# EAGLE schematic logger (EAGLE 6.4)
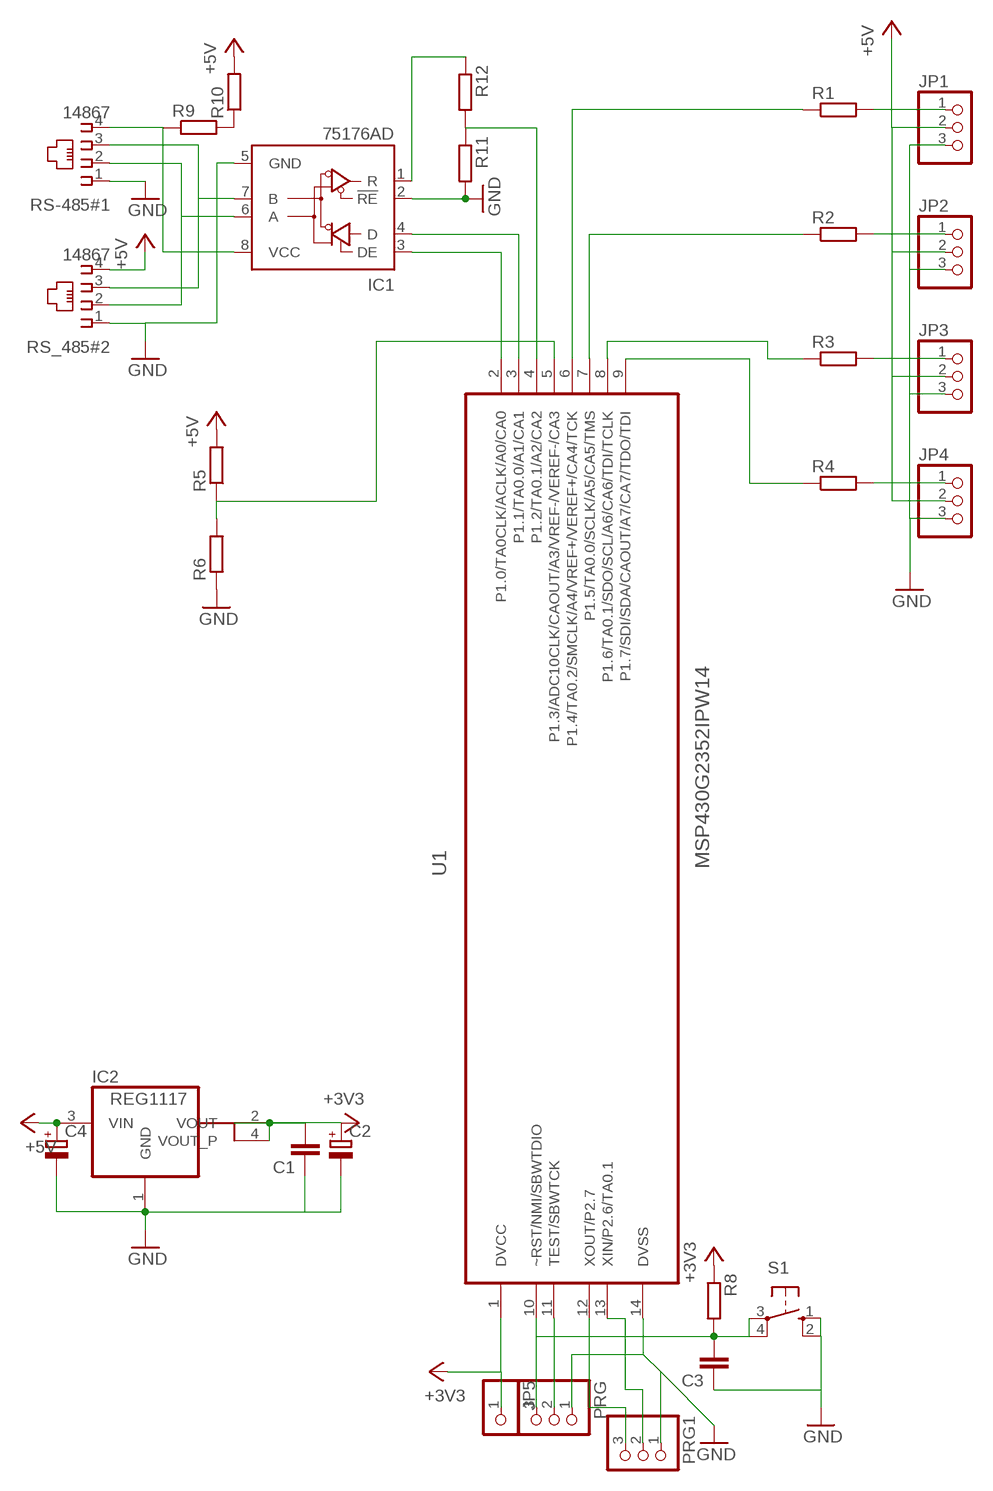
[diagram p0: schematic, sheet 1]

## Parts
C1  C-EUC0805  [C0805]
C2  CPOL-EUE2,5-6E  [E2,5-6E]
C3  C-EUC0805  [C0805]
C4  CPOL-EUE2,5-6E  [E2,5-6E]
IC1  75176AD  [D_R-PDSO-G8]
IC2  REG1117  [SOT223]
JP1  PINHD-1X3  [1X03]
JP2  PINHD-1X3  [1X03]
JP3  PINHD-1X3  [1X03]
JP4  PINHD-1X3  [1X03]
JP5  PINHD-1X1  [1X01]
PRG  PINHD-1X3  [1X03]
PRG1  PINHD-1X3  [1X03]
R1  R-EU_R0805  [R0805]
R2  R-EU_R0805  [R0805]
R3  R-EU_R0805  [R0805]
R4  R-EU_R0805  [R0805]
R5  R-EU_R0805  [R0805]
R6  R-EU_R0805  [R0805]
R8  R-EU_R0805  [R0805]
R9  R-EU_R1206  [R1206]
R10  R-EU_R1206  [R1206]
R11  R-EU_R0805  [R0805]
R12  R-EU_R0805  [R0805]
RS-485#1  14867  [14867]
RS_485#2  14867  [14867]
S1  10-XX  [B3F-10XX]
U1  MSP430G2352IPW14  [SOP65P640X120-14N]

## Nets
+3V3: C1.2 C2.+ IC2.2(VOUT) IC2.4(VOUT_P) JP5.1 R8.1 U1.1(DVCC)
+5V: C4.+ IC2.3(VIN) JP1.2 JP2.2 JP3.2 JP4.2 R5.2 R10.2 RS_485#2.4
GND: C1.1 C2.- C3.1 C4.- IC1.2(!RE) IC1.5(GND) IC2.1(GND) JP1.3 JP2.3 JP3.3 JP4.3 PRG1.1 PRG.1 R6.1 R11.2 RS-485#1.1 RS_485#2.1 S1.1(S) S1.2(S1) U1.14(DVSS)
N$1: IC1.6(A) RS-485#1.2 RS_485#2.2
N$2: IC1.7(B) RS-485#1.3 RS_485#2.3
N$3: R5.1 R6.2 U1.5(P1.3/ADC10CLK/CAOUT/A3/VREF-/VEREF-/CA3)
N$4: R4.1 U1.9(P1.7/SDI/SDA/CAOUT/A7/CA7/TDO/TDI)
N$5: JP4.1 R4.2
N$6: JP3.1 R3.2
N$7: JP2.1 R2.2
N$8: JP1.1 R1.2
N$9: R3.1 U1.8(P1.6/TA0.1/SDO/SCL/A6/CA6/TDI/TCLK)
N$10: R2.1 U1.7(P1.5/TA0.0/SCLK/A5/CA5/TMS)
N$11: R1.1 U1.6(P1.4/TA0.2/SMCLK/A4/VREF+/VEREF+/CA4/TCK)
N$12: PRG1.2 U1.13(XIN/P2.6/TA0.1)
N$13: IC1.4(D) U1.3(P1.1/TA0.0/A1/CA1)
N$14: IC1.3(DE) U1.2(P1.0/TA0CLK/ACLK/A0/CA0)
N$15: C3.2 PRG.3 R8.2 S1.3(P) S1.4(P1) U1.10(~RST/NMI/SBWTDIO)
N$16: PRG.2 U1.11(TEST/SBWTCK)
N$18: PRG1.3 U1.12(XOUT/P2.7)
N$19: R9.2 R10.1
N$20: IC1.8(VCC) R9.1 RS-485#1.4
N$21: IC1.1(R) R12.1
N$22: R11.1 R12.2 U1.4(P1.2/TA0.1/A2/CA2)

## Library data of the parts
C1 C3 = rcl:C-EU: CAPACITOR, European symbol
C2 C4 = rcl:CPOL-EU: POLARIZED CAPACITOR, European symbol
IC1 = 751xx:75176A: DIFFERENTIAL BUS TRANSCEIVER Source: http://focus.ti.com/lit/ds/symlink/sn75176a.pdf
IC2 = burr-brown:REG1117: 800mA and 1A Low Dropout (LDO) Positive Regulator 1.8V, 2.5V, 2.85V, 3.3V, 5V, and Adj; MPN: REG1117; OC_FARNELL: 1097566; OC_NEWARK: 14P6981
JP1-JP4 PRG PRG1 = pinhead:PINHD-1X3: PIN HEADER
JP5 = pinhead:PINHD-1X1: PIN HEADER
R1-R6 R8-R12 = rcl:R-EU_: RESISTOR, European symbol
RS-485#1 RS_485#2 = con-4ucon:14867: RJ11 Connector Source: 4UCON TECHNOLOGY INC. 14867.pdf; OC_FARNELL: unknown; OC_NEWARK: unknown
S1 = switch-omron:10-XX: OMRON SWITCH; MPN: B3F-1000; OC_FARNELL: 176432; OC_NEWARK: 36M3542
U1 = MSP430G2352IPW14:MSP430G2352IPW14: MIXED SIGNAL MICROCONTROLLER; MPN: MSP430G2352IPW14; OC_FARNELL: 1866895; OC_NEWARK: 24T4701; PACKAGE: TSSOP-14; SUPPLIER: Texas Instruments